# Altium schematic sheet 2Filters.SchDoc
size A1; SheetNumber: 2; SheetTotal: 2
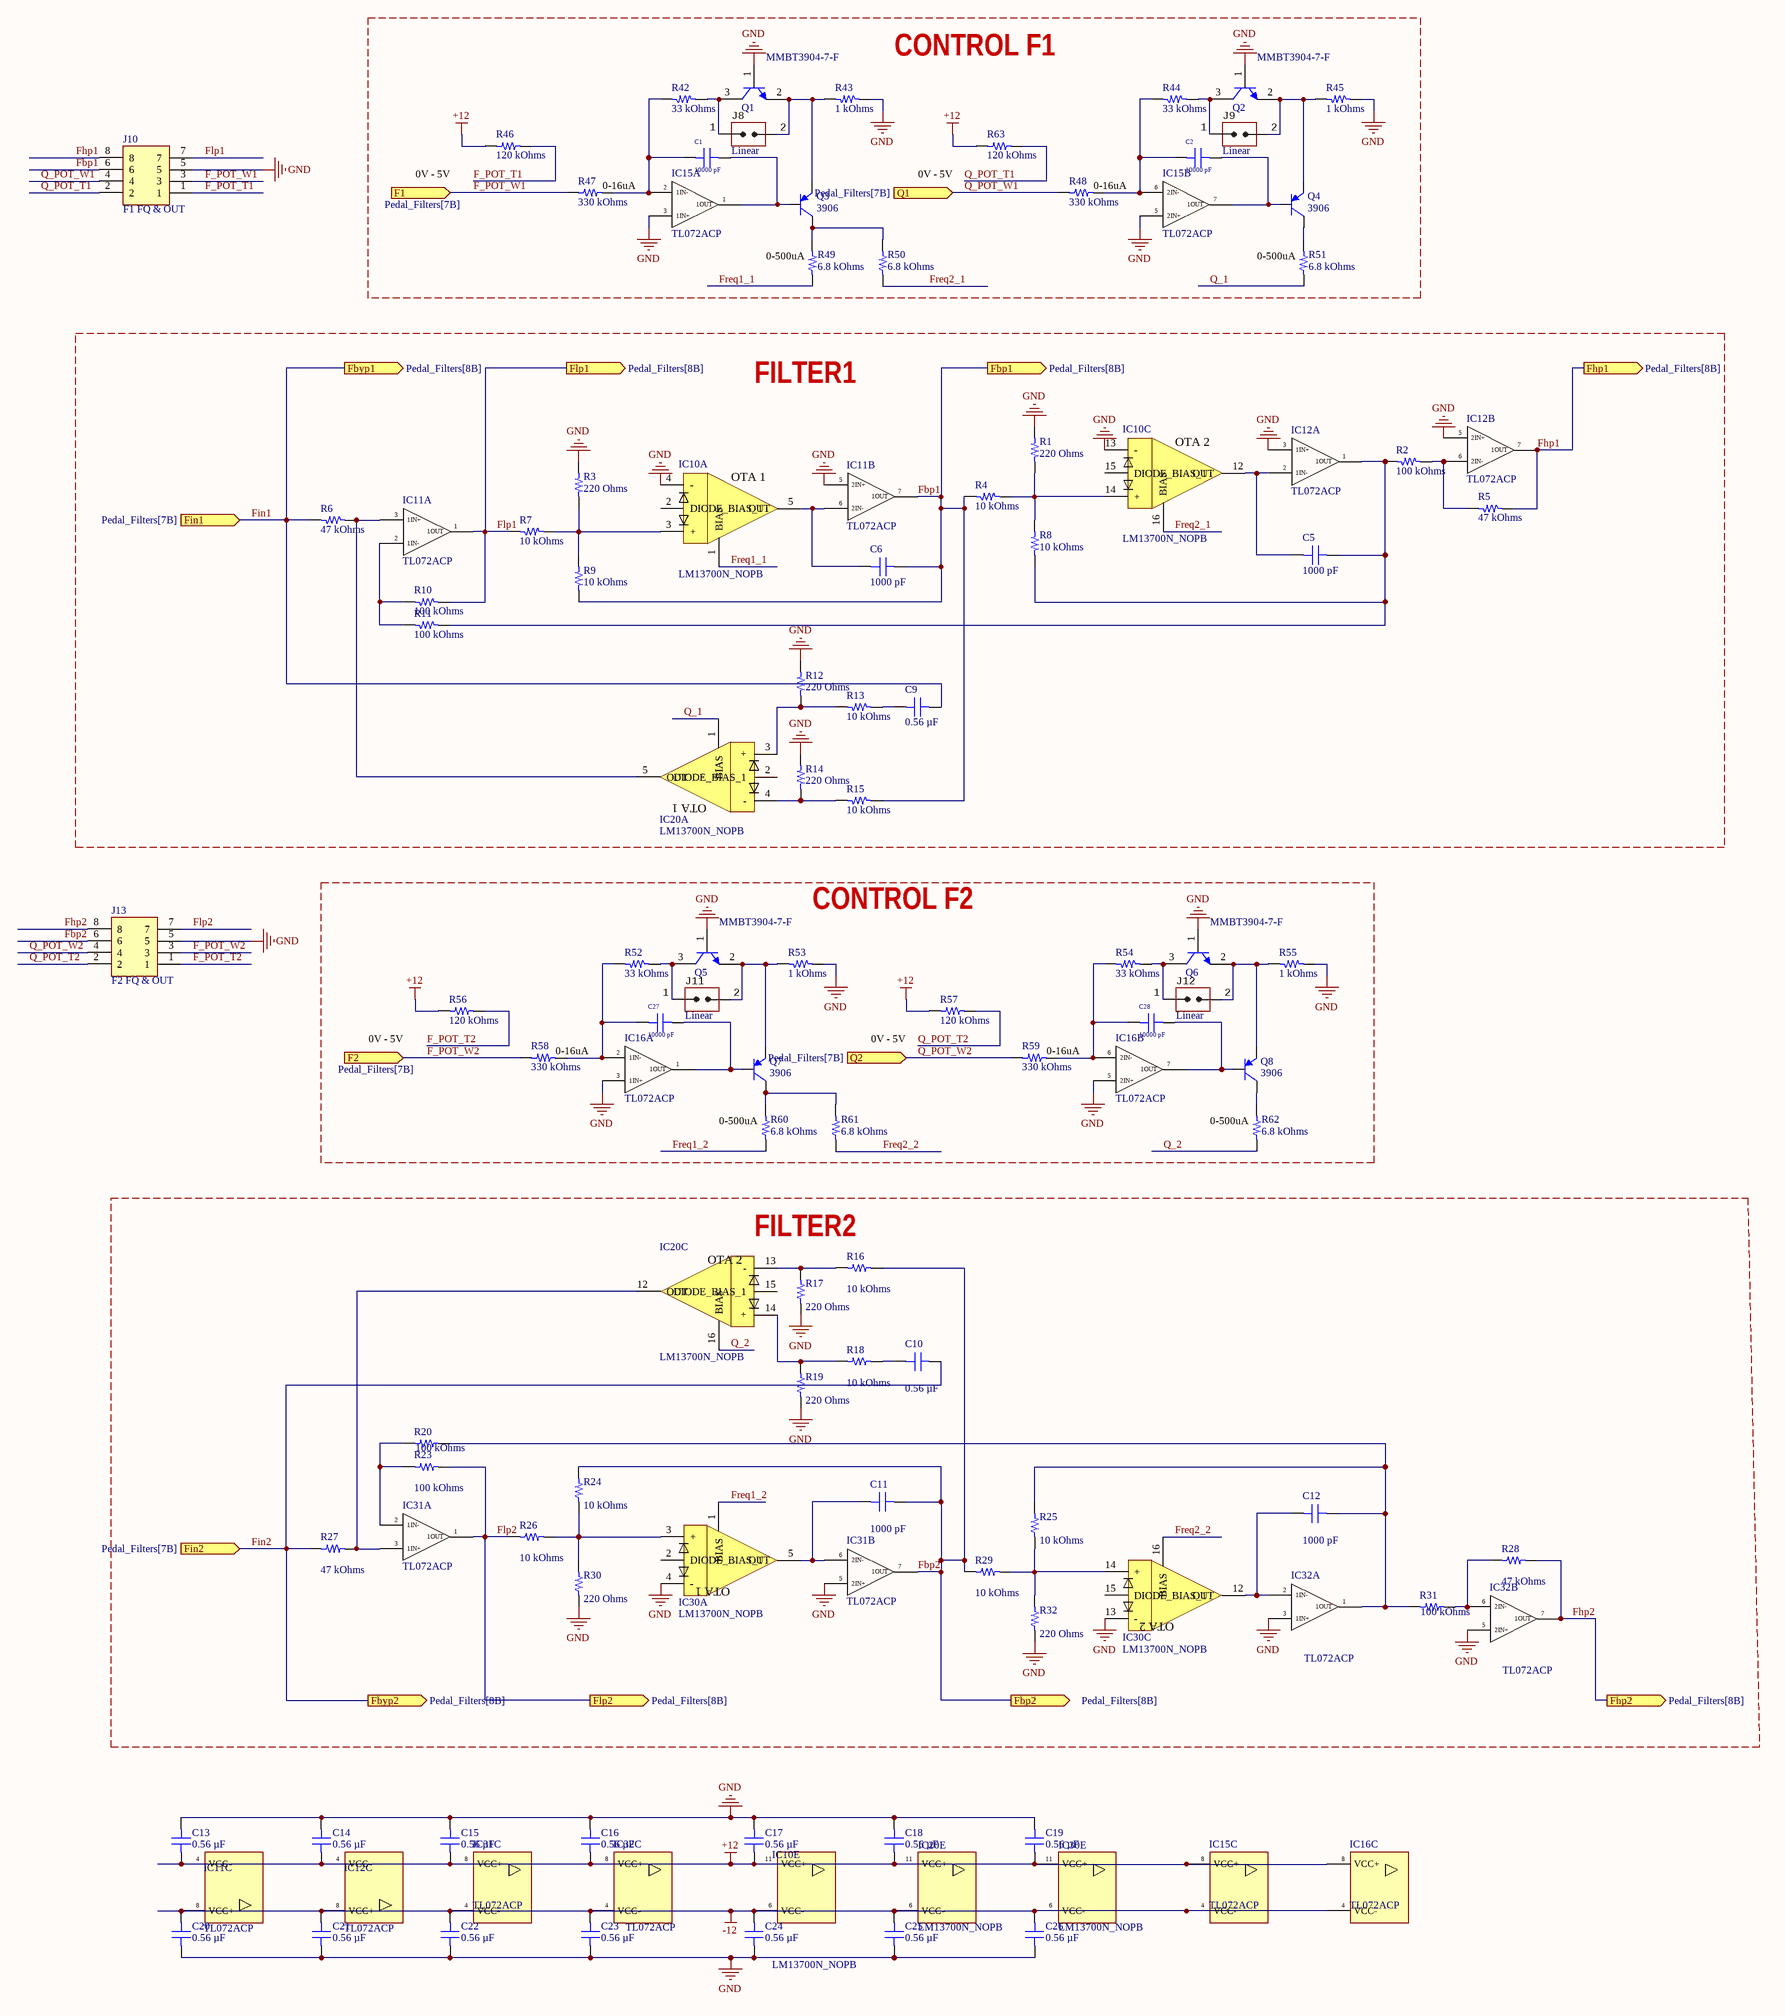
[diagram p0: 2Filters.SchDoc]

## Parts
C1  10000 pF  [MURATA GRM188 0603_1608]
C2  10000 pF  [MURATA GRM188 0603_1608]
C5  Capacitance: 1000 pF  [CAP 0805_2012]
C6  Capacitance: 1000 pF  [CAP 0805_2012]
C9  Capacitance: 0.56 µF  [CAP 0805_2012]
C10  Capacitance: 0.56 µF  [CAP 0805_2012]
C11  Capacitance: 1000 pF  [CAP 0805_2012]
C12  Capacitance: 1000 pF  [CAP 0805_2012]
C13  Capacitance: 0.56 µF  [CAP 0805_2012]
C14  Capacitance: 0.56 µF  [CAP 0805_2012]
C15  Capacitance: 0.56 µF  [CAP 0805_2012]
C16  Capacitance: 0.56 µF  [CAP 0805_2012]
C17  Capacitance: 0.56 µF  [CAP 0805_2012]
C18  Capacitance: 0.56 µF  [CAP 0805_2012]
C19  Capacitance: 0.56 µF  [CAP 0805_2012]
C20  Capacitance: 0.56 µF  [CAP 0805_2012]
C21  Capacitance: 0.56 µF  [CAP 0805_2012]
C22  Capacitance: 0.56 µF  [CAP 0805_2012]
C23  Capacitance: 0.56 µF  [CAP 0805_2012]
C24  Capacitance: 0.56 µF  [CAP 0805_2012]
C25  Capacitance: 0.56 µF  [CAP 0805_2012]
C26  Capacitance: 0.56 µF  [CAP 0805_2012]
C27  10000 pF  [MURATA GRM188 0603_1608]
C28  10000 pF  [MURATA GRM188 0603_1608]
IC10  LM13700N_NOPB  [SOIC-16]  (parts A,C,E of 5)
IC11  TL072ACP  [SOIC-8]  (parts A,B,C of 3)
IC12  TL072ACP  [SOIC-8]  (parts A,B,C of 3)
IC15  TL072ACP  [SOIC-8]  (parts A,B,C of 3)
IC16  TL072ACP  [SOIC-8]  (parts A,B,C of 3)
IC20  LM13700N_NOPB  [SOIC-16]  (parts A,C,E of 5)
IC30  LM13700N_NOPB  [SOIC-16]  (parts A,C,E of 5)
IC31  TL072ACP  [SOIC-8]  (parts A,B,C of 3)
IC32  TL072ACP  [SOIC-8]  (parts A,B,C of 3)
J8  Linear  [CON: JUMPER x1]
J9  Linear  [CON: JUMPER x1]
J10  F1 FQ & OUT  [LPPB042NFSSRC]
J11  Linear  [CON: JUMPER x1]
J12  Linear  [CON: JUMPER x1]
J13  F2 FQ & OUT  [LPPB042NFSSRC]
Q1  MMBT3904-7-F  [DIODES SOT-23-3]
Q2  MMBT3904-7-F  [DIODES SOT-23-3]
Q3  3906  [SOT-23]
Q4  3906  [SOT-23]
Q5  MMBT3904-7-F  [DIODES SOT-23-3]
Q6  MMBT3904-7-F  [DIODES SOT-23-3]
Q7  3906  [SOT-23]
Q8  3906  [SOT-23]
R1  220 Ohms  [RES 0603_1608]
R2  100 kOhms  [RES 0603_1608]
R3  220 Ohms  [RES 0603_1608]
R4  10 kOhms  [RES 0603_1608]
R5  47 kOhms  [RES 0603_1608]
R6  47 kOhms  [RES 0603_1608]
R7  10 kOhms  [RES 0603_1608]
R8  10 kOhms  [RES 0603_1608]
R9  10 kOhms  [RES 0603_1608]
R10  100 kOhms  [RES 0603_1608]
R11  100 kOhms  [RES 0603_1608]
R12  220 Ohms  [RES 0603_1608]
R13  10 kOhms  [RES 0603_1608]
R14  220 Ohms  [RES 0603_1608]
R15  10 kOhms  [RES 0603_1608]
R16  10 kOhms  [RES 0603_1608]
R17  220 Ohms  [RES 0603_1608]
R18  10 kOhms  [RES 0603_1608]
R19  220 Ohms  [RES 0603_1608]
R20  100 kOhms  [RES 0603_1608]
R23  100 kOhms  [RES 0603_1608]
R24  10 kOhms  [RES 0603_1608]
R25  10 kOhms  [RES 0603_1608]
R26  10 kOhms  [RES 0603_1608]
R27  47 kOhms  [RES 0603_1608]
R28  47 kOhms  [RES 0603_1608]
R29  10 kOhms  [RES 0603_1608]
R30  220 Ohms  [RES 0603_1608]
R31  100 kOhms  [RES 0603_1608]
R32  220 Ohms  [RES 0603_1608]
R42  33 kOhms  [YAGEO RES 0603_1608]
R43  1 kOhms  [YAGEO RES 0603_1608]
R44  33 kOhms  [YAGEO RES 0603_1608]
R45  1 kOhms  [YAGEO RES 0603_1608]
R46  120 kOhms  [YAGEO RES 0603_1608]
R47  330 kOhms  [YAGEO RES 0603_1608]
R48  330 kOhms  [YAGEO RES 0603_1608]
R49  6.8 kOhms  [YAGEO RES 0603_1608]
R50  6.8 kOhms  [YAGEO RES 0603_1608]
R51  6.8 kOhms  [YAGEO RES 0603_1608]
R52  33 kOhms  [YAGEO RES 0603_1608]
R53  1 kOhms  [YAGEO RES 0603_1608]
R54  33 kOhms  [YAGEO RES 0603_1608]
R55  1 kOhms  [YAGEO RES 0603_1608]
R56  120 kOhms  [YAGEO RES 0603_1608]
R57  120 kOhms  [YAGEO RES 0603_1608]
R58  330 kOhms  [YAGEO RES 0603_1608]
R59  330 kOhms  [YAGEO RES 0603_1608]
R60  6.8 kOhms  [YAGEO RES 0603_1608]
R61  6.8 kOhms  [YAGEO RES 0603_1608]
R62  6.8 kOhms  [YAGEO RES 0603_1608]
R63  120 kOhms  [YAGEO RES 0603_1608]

## Blocks framed on the sheet
CONTROL F1: C1 C2 IC15 J8 J9 Q1-Q4 R42-R51 R63
FILTER1: C5 C6 C9 IC10-IC12 IC20 R1-R15
CONTROL F2: C27 C28 IC16 J11 J12 Q5-Q8 R52-R62
FILTER2: C10-C12 IC20 IC30-IC32 R16-R20 R23-R32

## Ports
F1 (in, see Pedal_Filters[7B]), F2 (in, see Pedal_Filters[7B]), Fbp1 (out, see Pedal_Filters[8B]), Fbp2 (out, see Pedal_Filters[8B]), Fbyp1 (out, see Pedal_Filters[8B]), Fbyp2 (out, see Pedal_Filters[8B]), Fhp1 (out, see Pedal_Filters[8B]), Fhp2 (out, see Pedal_Filters[8B]), Fin1 (in, see Pedal_Filters[7B]), Fin2 (in, see Pedal_Filters[7B]), Flp1 (out, see Pedal_Filters[8B]), Flp2 (out, see Pedal_Filters[8B]), Q1 (in, see Pedal_Filters[7B]), Q2 (in, see Pedal_Filters[7B])

## Nets
+12: C13.1 C14.1 C15.1 C16.1 C17.1 C18.1 C19.1 IC10.11(VCC+) IC11.4(VCC-) IC12.4(VCC-) IC15.8(VCC+) IC16.8(VCC+) IC20.11(VCC+) IC30.11(VCC+) IC31.8(VCC+) IC32.8(VCC+) R46.1 R56.1 R57.1 R63.1
-12: C20.2 C21.2 C22.2 C23.2 C24.2 C25.2 C26.2 IC10.6(VCC-) IC11.8(VCC+) IC12.8(VCC+) IC15.4(VCC-) IC16.4(VCC-) IC20.6(VCC-) IC30.6(VCC-) IC31.4(VCC-) IC32.4(VCC-)
GND: C13.2 C14.2 C15.2 C16.2 C17.2 C18.2 C19.2 C20.1 C21.1 C22.1 C23.1 C24.1 C25.1 C26.1 IC10.4(-) IC10.13(-) IC11.5(2IN+) IC12.3(1IN+) IC12.5(2IN+) IC15.3(1IN+) IC15.5(2IN+) IC16.3(1IN+) IC16.5(2IN+) IC30.4(-) IC30.13(-) IC31.5(2IN+) IC32.3(1IN+) IC32.5(2IN+) J10.5 J13.5 Q1.1(B) Q2.1(B) Q5.1(B) Q6.1(B) R1.1 R3.1 R12.1 R14.1 R17.1 R19.1 R30.1 R32.1 R43.2 R45.2 R53.2 R55.2
F_POT_T1: J10.1 R46.2
F_POT_T2: J13.1 R56.2
F_POT_W1: J10.3 R47.1 ; port F1
F_POT_W2: J13.3 R58.1 ; port F2
Fbp1: C6.1 IC11.7(1OUT) J10.6 R4.1 R9.2 R15.2 ; port Fbp1
Fbp2: C11.1 IC31.7(1OUT) J13.6 R16.2 R24.2 R29.1 ; port Fbp2
Fhp1: IC12.7(1OUT) J10.8 R5.2 ; port Fhp1
Fhp2: IC32.7(1OUT) J13.8 R28.2 ; port Fhp2
Fin1: C9.2 R6.1 ; port Fbyp1, port Fin1
Fin2: C10.2 R27.1 ; port Fin2, port Fbyp2
Flp1: IC11.1(1OUT) J10.7 R7.1 R10.2 ; port Flp1
Flp2: IC31.1(1OUT) J13.7 R23.2 R26.1 ; port Flp2
Freq1_1: IC10.1(BIAS) R49.1
Freq1_2: IC30.1(BIAS) R60.1
Freq2_1: IC10.16(BIAS) R50.1
Freq2_2: IC30.16(BIAS) R61.1
Q_1: IC20.1(BIAS) R51.1
Q_2: IC20.16(BIAS) R62.1
Q_POT_T1: J10.2 R63.2
Q_POT_T2: J13.2 R57.2
Q_POT_W1: J10.4 R48.1 ; port Q1
Q_POT_W2: J13.4 R59.1 ; port Q2
NetC1_1: C1.1 IC15.1(1OUT) Q3.1(B)
NetC1_2: C1.2 IC15.2(1IN-) R42.1 R47.2
NetC2_1: C2.1 IC15.7(1OUT) Q4.1(B)
NetC2_2: C2.2 IC15.6(2IN-) R44.1 R48.2
NetC5_1: C5.1 IC12.1(1OUT) R2.1 R8.2 R11.2
NetC5_2: C5.2 IC10.12(OUT) IC12.2(1IN-)
NetC6_2: C6.2 IC10.5(OUT) IC11.6(2IN-)
NetC9_1: C9.1 R13.2
NetC10_1: C10.1 R18.2
NetC11_2: C11.2 IC30.5(OUT) IC31.6(2IN-)
NetC12_1: C12.1 IC32.1(1OUT) R20.2 R25.2 R31.1
NetC12_2: C12.2 IC30.12(OUT) IC32.2(1IN-)
NetC27_1: C27.1 IC16.1(1OUT) Q7.1(B)
NetC27_2: C27.2 IC16.2(1IN-) R52.1 R58.2
NetC28_1: C28.1 IC16.7(1OUT) Q8.1(B)
NetC28_2: C28.2 IC16.6(2IN-) R54.1 R59.2
NetIC10_3: IC10.3(+) R3.2 R7.2 R9.1
NetIC10_14: IC10.14(+) R1.2 R4.2 R8.1
NetIC11_2: IC11.2(1IN-) R10.1 R11.1
NetIC11_3: IC11.3(1IN+) IC20.5(OUT) R6.2
NetIC12_6: IC12.6(2IN-) R2.2 R5.1
NetIC20_3: IC20.3(+) R12.2 R13.1
NetIC20_4: IC20.4(-) R14.2 R15.1
NetIC20_12: IC20.12(OUT) IC31.3(1IN+) R27.2
NetIC20_13: IC20.13(-) R16.1 R17.2
NetIC20_14: IC20.14(+) R18.1 R19.2
NetIC30_3: IC30.3(+) R24.1 R26.2 R30.2
NetIC30_14: IC30.14(+) R25.1 R29.2 R32.2
NetIC31_2: IC31.2(1IN-) R20.1 R23.1
NetIC32_6: IC32.6(2IN-) R28.1 R31.2
NetJ8_1: J8.1(IN) Q1.3(C) R42.2
NetJ8_2: J8.2(IN) Q1.2(E) Q3.2(E) R43.1
NetJ9_1: J9.1(IN) Q2.3(C) R44.2
NetJ9_2: J9.2(IN) Q2.2(E) Q4.2(E) R45.1
NetJ11_1: J11.1(IN) Q5.3(C) R52.2
NetJ11_2: J11.2(IN) Q5.2(E) Q7.2(E) R53.1
NetJ12_1: J12.1(IN) Q6.3(C) R54.2
NetJ12_2: J12.2(IN) Q6.2(E) Q8.2(E) R55.1
NetQ3_3: Q3.3(C) R49.2 R50.2
NetQ4_3: Q4.3(C) R51.2
NetQ7_3: Q7.3(C) R60.2 R61.2
NetQ8_3: Q8.3(C) R62.2

Not connected (* = marked no-connect by the designer): IC10 2(DIODE_BIAS_1) 15(DIODE_BIAS_1); IC20 2(DIODE_BIAS_1) 15(DIODE_BIAS_1); IC30 2(DIODE_BIAS_1) 15(DIODE_BIAS_1)

## Notes on the sheet
- 0V - 5V
- (near R47) 0-16uA
- (near R63) 0V - 5V
- (near R48) 0-16uA
- (near R49) 0-500uA
- (near R51) 0-500uA
- (near R58) 0-16uA
- (near R57) 0V - 5V
- (near R59) 0-16uA
- (near R60) 0-500uA
- (near R62) 0-500uA
- (in symbol LM13700N_NOPB, part A) OTA 1
- (in symbol LM13700N_NOPB, part C) OTA 2

## Library data of the parts
C1 C2 C27 C28 = GRM1885C1H103JA01D: CAP CER 10000PF 50V C0G/NP0 0603; manufacturer: Murata Electronics; Temperature Coefficient: C0G, NP0; Tolerance: ±5%; Part Number: GRM1885C1H103JA01D; Capacitance: 10000 pF; Applications: General Purpose; componentlink1description: Datasheet; componentlink1url: https://www.murata.com/~/media/webrenewal/support/library/catalog/products/capacitor/mlcc/c02e.ashx?la=en-us; componentlink2description: DigiKey Link; componentlink2url: https://www.digikey.com/en/products/detail/murata-electronics/GRM1885C1H103JA01D/4421555; Device Package: 0603 (1608 Metric); lastupdated: 7/20/2024 12:23:21 AM; Lifecycle Status: Active; Minimum Order: 1; Mounting Type: Surface Mount, MLCC; Operating Temperature: -55°C ~ 125°C; Package / Case: 0603 (1608 Metric); packaging: TapeAndReel; partid: 11077; Part Status: Active; price: 0.02; series: GRM; Size / Dimension: 0.063" L x 0.031" W (1.60mm x 0.80mm); Supplier 1: DigiKey; Supplier Part Number 1: 490-9666-1-ND; Thickness (Max): 0.035" (0.90mm); value: 10000 pF; Voltage - Rated: 50V
C5 C6 C11 C12 = C0805X102J5HACAUTO: CAP CER 0805 1NF 50V ULTRA STABL; Part Number: C0805X102J5HACAUTO
C9 C10 C13-C26 = C0805C564K5RAC7800: CAP CER 0.56UF 50V X7R 0805; Part Number: C0805C564K5RAC7800
IC10 IC20 IC30 = LM13700N_NOPB: Integrated Circuit; Manufacturer_Name: Texas Instruments; Manufacturer_Part_Number: LM13700N/NOPB; Datasheet Link: http://www.ti.com/lit/ds/symlink/lm13700.pdf; Height: 4.318mm; Mouser Part Number: 926-LM13700N/NOPB; Mouser Price/Stock: https://www.mouser.co.uk/ProductDetail/Texas-Instruments/LM13700N-NOPB?qs=X1J7HmVL2ZFKw9D7azZDXw%3D%3D; Arrow Part Number: LM13700N/NOPB; Arrow Price/Stock: https://www.arrow.com/en/products/lm13700nnopb/texas-instruments?region=nac
IC11 IC12 IC15 IC16 IC31 IC32 = TL072ACP: Integrated Circuit; Manufacturer_Name: Texas Instruments; Datasheet Link: http://www.ti.com/lit/ds/symlink/tl071a.pdf; Height: 5.08mm; Manufacturer_Part_Number: TL072ACP; Mouser Part Number: 595-TL072ACP; Mouser Price/Stock: https://www.mouser.co.uk/ProductDetail/Texas-Instruments/TL072ACP?qs=0OT4q4QBUTLFvIZ%252B%2FvrwoQ%3D%3D; Arrow Part Number: TL072ACP; Arrow Price/Stock: https://www.arrow.com/en/products/tl072acp/texas-instruments?utm_currency=USD&region=europe
J8 J9 J11 J12 = Jumper_single: CommentText: "Перемычка"
J10 J13 = LPPB042NFSS-RC: Connector; Manufacturer_Name: Sullins; Datasheet Link: https://www.sullinscorp.com/drawings/88_LPPB___2NFSS-RC,_11017.pdf; Height: 4.65mm; Manufacturer_Part_Number: LPPB042NFSS-RC
Q1 Q2 Q5 Q6 = MMBT3904-7-F: TRANS NPN 40V 0.2A SOT23-3; Manufacturer: Diodes Incorporated; Current - Collector Cutoff (Max): 50nA (ICBO); Current - Collector (Ic) (Max): 200 mA; DC Current Gain (hFE) (Min) @ Ic, Vce: 100 @ 10mA, 1V; Frequency - Transition: 300MHz; Power - Max: 300 mW; Vce Saturation (Max) @ Ib, Ic: 300mV @ 5mA, 50mA; Part Number: MMBT3904-7-F; ComponentLink1Description: Datasheet; ComponentLink1URL: https://www.diodes.com/assets/Datasheets/ds30036.pdf; ComponentLink2Description: DigiKey Link; ComponentLink2URL: https://www.digikey.com/en/products/detail/diodes-incorporated/MMBT3904-7-F/814494; LastUpdated: 2/8/2024 9:54:04 PM; Lifecycle Status: Active; Minimum Order: 1; Mounting Type: Surface Mount; Operating Temperature: -55°C ~ 150°C (TJ); Package / Case: TO-236-3, SC-59, SOT-23-3; Packaging: TapeAndReel; PartId: 85; Part Status: Active; Price: 0.01; Series: -; Supplier 1: DigiKey; Supplier Part Number 1: MMBT3904-FDICT-ND; Supplier Device Package: SOT-23-3; Transistor Type: NPN; Voltage - Collector Emitter Breakdown (Max): 40 V
Q3 Q4 Q7 Q8 = MMBT3906
R1 R3 R12 R14 R17 R19 R30 R32 = CRCW0603220RFKEA: RES SMD 220 OHM 1% 1/10W 0603; Part Number: CRCW0603220RFKEA; Value: 220 Ohms
R2 R10 R11 R20 R23 R31 = CPF0603F100KC1: RES SMD 100K OHM 1% 1/16W 0603; Part Number: CPF0603F100KC1; Value: 100 kOhms
R4 R7-R9 R13 R15 R16 R18 R24-R26 R29 = CRCW060310K0FKEA: RES SMD 10K OHM 1% 1/10W 0603; Part Number: CRCW060310K0FKEA; Value: 10 kOhms
R5 R6 R27 R28 = CRCW060347K0FKEAHP: RES SMD 47K OHM 1% 1/3W 0603; Part Number: CRCW060347K0FKEAHP; Value: 47 kOhms
R42 R44 R52 R54 = AC0603FR-0733KL: RES SMD 33K OHM 1% 1/10W 0603; Manufacturer: Yageo; Power (Watts): 0.1W, 1/10W; Temperature Coefficient: ±100ppm/°C; Part Number: AC0603FR-0733KL; Value: 33 kOhms; ComponentLink1Description: Datasheet; ComponentLink1URL: https://www.yageo.com/upload/media/product/productsearch/datasheet/rchip/PYu-AC_51_RoHS_L_7.pdf; ComponentLink2Description: DigiKey Link; ComponentLink2URL: https://www.digikey.com/en/products/detail/yageo/AC0603FR-0733KL/5896041; Composition: Thick Film; Device Package: 0603 (1608 Metric); Features: Automotive AEC-Q200, Moisture Resistant; Height - Seated (Max): 0.022" (0.55mm); LastUpdated: 7/25/2024 9:19:23 AM; Lifecycle Status: Active; Minimum Order: 1; Number of Terminations: 2; Operating Temperature: -55°C ~ 155°C; Package / Case: 0603 (1608 Metric); Packaging: CutTape; PartId: 17385; Part Status: Active; Price: 0.01; Ratings: AEC-Q200; Resistance: 33 kOhms; Series: AC; Size / Dimension: 0.063" L x 0.031" W (1.60mm x 0.80mm); Supplier 1: DigiKey; Supplier Part Number 1: YAG3598CT-ND; Supplier Device Package: 0603; Tolerance: ±1%
R43 R45 R53 R55 = AA0603FR-071KL: RES SMD 1K OHM 1% 1/10W 0603; Manufacturer: Yageo; Power (Watts): 0.1W, 1/10W; Temperature Coefficient: ±150ppm/°C; Part Number: AA0603FR-071KL; Value: 1 kOhms; ComponentLink1Description: Datasheet; ComponentLink1URL: https://www.yageo.com/upload/media/product/productsearch/datasheet/rchip/PYu-AA_51_RoHS_L_3.pdf; ComponentLink2Description: DigiKey Link; ComponentLink2URL: https://www.digikey.com/en/products/detail/yageo/AA0603FR-071KL/5888847; Composition: Thick Film; Device Package: 0603 (1608 Metric); Features: Anti-Sulfur, Automotive AEC-Q200, Moisture Resistant; Height - Seated (Max): 0.022" (0.55mm); LastUpdated: 7/25/2024 9:19:15 AM; Lifecycle Status: Active; Minimum Order: 1; Number of Terminations: 2; Operating Temperature: -55°C ~ 155°C; Package / Case: 0603 (1608 Metric); Packaging: TapeAndReel; PartId: 64335; Part Status: Active; Price: 0.01; Ratings: AEC-Q200; Resistance: 1 kOhms; Series: AA; Size / Dimension: 0.063" L x 0.031" W (1.60mm x 0.80mm); Supplier 1: DigiKey; Supplier Part Number 1: 13-AA0603FR-071KLCT-ND; Supplier Device Package: 0603; Tolerance: ±1%
R46 R56 R57 R63 = AC0603FR-07120KL: RES SMD 120K OHM 1% 1/10W 0603; Manufacturer: Yageo; Power (Watts): 0.1W, 1/10W; Temperature Coefficient: ±100ppm/°C; Part Number: AC0603FR-07120KL; Value: 120 kOhms; ComponentLink1Description: Datasheet; ComponentLink1URL: https://www.yageo.com/upload/media/product/productsearch/datasheet/rchip/PYu-AC_51_RoHS_L_7.pdf; ComponentLink2Description: DigiKey Link; ComponentLink2URL: https://www.digikey.com/en/products/detail/yageo/AC0603FR-07120KL/5895760; Composition: Thick Film; Device Package: 0603 (1608 Metric); Features: Automotive AEC-Q200, Moisture Resistant; Height - Seated (Max): 0.022" (0.55mm); LastUpdated: 7/25/2024 9:19:23 AM; Lifecycle Status: Active; Minimum Order: 1; Number of Terminations: 2; Operating Temperature: -55°C ~ 155°C; Package / Case: 0603 (1608 Metric); Packaging: CutTape; PartId: 17461; Part Status: Active; Price: 0.01; Ratings: AEC-Q200; Resistance: 120 kOhms; Series: AC; Size / Dimension: 0.063" L x 0.031" W (1.60mm x 0.80mm); Supplier 1: DigiKey; Supplier Part Number 1: YAG3562CT-ND; Supplier Device Package: 0603; Tolerance: ±1%
R47 R48 R58 R59 = AC0603FR-07330KL: RES SMD 330K OHM 1% 1/10W 0603; Manufacturer: Yageo; Power (Watts): 0.1W, 1/10W; Temperature Coefficient: ±100ppm/°C; Part Number: AC0603FR-07330KL; Value: 330 kOhms; ComponentLink1Description: Datasheet; ComponentLink1URL: https://www.yageo.com/upload/media/product/productsearch/datasheet/rchip/PYu-AC_51_RoHS_L_7.pdf; ComponentLink2Description: DigiKey Link; ComponentLink2URL: https://www.digikey.com/en/products/detail/yageo/AC0603FR-07330KL/5896036; Composition: Thick Film; Device Package: 0603 (1608 Metric); Features: Automotive AEC-Q200, Moisture Resistant; Height - Seated (Max): 0.022" (0.55mm); LastUpdated: 7/25/2024 9:19:23 AM; Lifecycle Status: Active; Minimum Order: 1; Number of Terminations: 2; Operating Temperature: -55°C ~ 155°C; Package / Case: 0603 (1608 Metric); Packaging: CutTape; PartId: 17469; Part Status: Active; Price: 0.01; Ratings: AEC-Q200; Resistance: 330 kOhms; Series: AC; Size / Dimension: 0.063" L x 0.031" W (1.60mm x 0.80mm); Supplier 1: DigiKey; Supplier Part Number 1: YAG3594CT-ND; Supplier Device Package: 0603; Tolerance: ±1%
R49-R51 R60-R62 = AC0603FR-076K8L: RES SMD 6.8K OHM 1% 1/10W 0603; Manufacturer: Yageo; Power (Watts): 0.1W, 1/10W; Temperature Coefficient: ±100ppm/°C; Part Number: AC0603FR-076K8L; Value: 6.8 kOhms; ComponentLink1Description: Datasheet; ComponentLink1URL: https://www.yageo.com/upload/media/product/productsearch/datasheet/rchip/PYu-AC_51_RoHS_L_7.pdf; ComponentLink2Description: DigiKey Link; ComponentLink2URL: https://www.digikey.com/en/products/detail/yageo/AC0603FR-076K8L/5896266; Composition: Thick Film; Device Package: 0603 (1608 Metric); Features: Automotive AEC-Q200, Moisture Resistant; Height - Seated (Max): 0.022" (0.55mm); LastUpdated: 7/25/2024 9:19:23 AM; Lifecycle Status: Active; Minimum Order: 1; Number of Terminations: 2; Operating Temperature: -55°C ~ 155°C; Package / Case: 0603 (1608 Metric); Packaging: CutTape; PartId: 17383; Part Status: Active; Price: 0.01; Ratings: AEC-Q200; Resistance: 6.8 kOhms; Series: AC; Size / Dimension: 0.063" L x 0.031" W (1.60mm x 0.80mm); Supplier 1: DigiKey; Supplier Part Number 1: YAG3627CT-ND; Supplier Device Package: 0603; Tolerance: ±1%